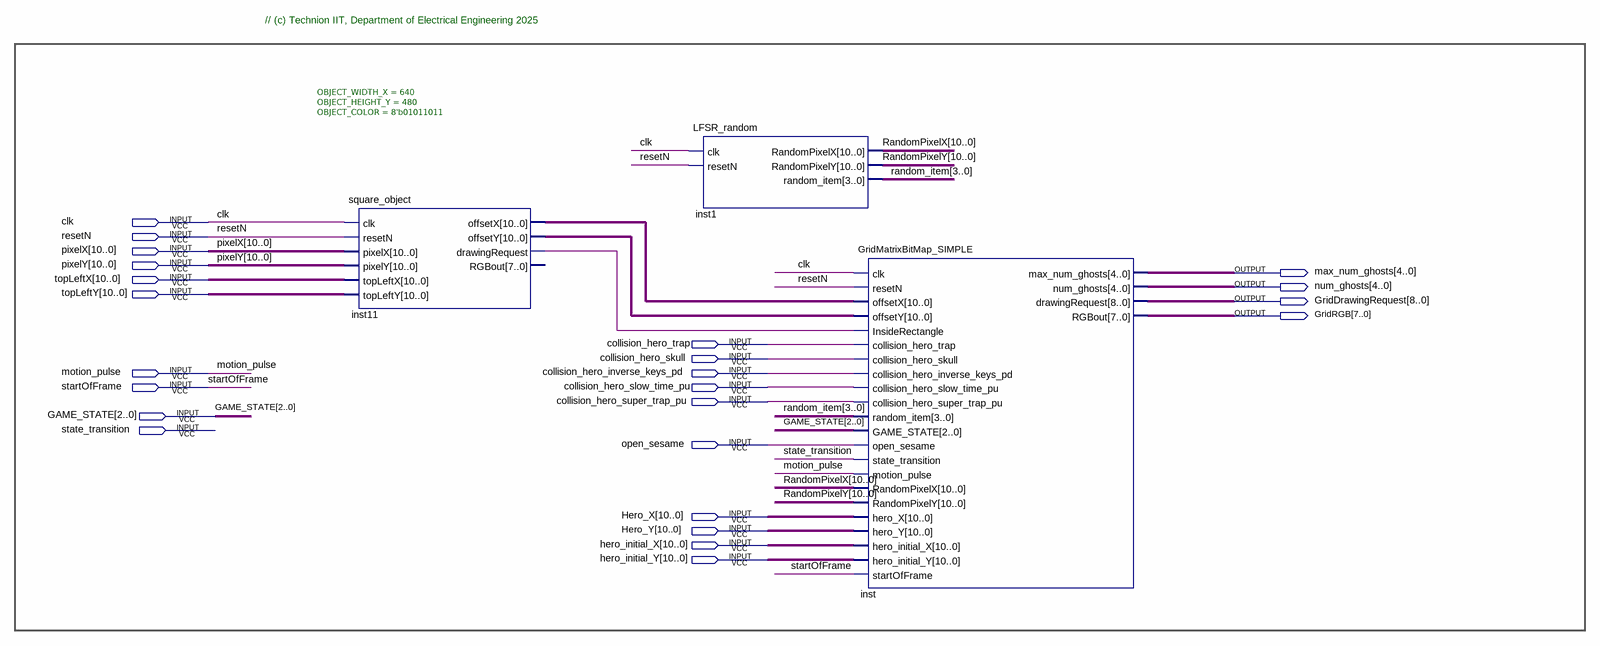
[diagram p0: schematic sheet]
// Quartus schematic OBJECTS_GRID.bdf as structural Verilog: 3 symbols, 24 pins
module OBJECTS_GRID (
  input  clk,
  input  resetN,
  input  [10:0] pixelX,
  input  [10:0] pixelY,
  input  [10:0] topLeftX,
  input  [10:0] topLeftY,
  input  collision_hero_trap,
  input  collision_hero_skull,
  input  motion_pulse,
  input  collision_hero_inverse_keys_pd,
  input  startOfFrame,
  input  collision_hero_slow_time_pu,
  input  collision_hero_super_trap_pu,
  input  [2:0] GAME_STATE,
  input  state_transition,
  input  open_sesame,
  input  [10:0] Hero_X,
  input  [10:0] Hero_Y,
  input  [10:0] hero_initial_X,
  input  [10:0] hero_initial_Y,
  output [4:0] max_num_ghosts,
  output [4:0] num_ghosts,
  output [8:0] GridDrawingRequest,
  output [7:0] GridRGB
);

  wire inst11_drawingrequest;
  wire [3:0] random_item;
  wire [10:0] inst11_offsetx, inst11_offsety, RandomPixelX, RandomPixelY;

  square_object #(.OBJECT_WIDTH_X(640), .OBJECT_HEIGHT_Y(480), .OBJECT_COLOR(8'b01011011)) inst11 (
    .clk(clk), .resetN(resetN), .pixelX(pixelX), .pixelY(pixelY), .topLeftX(topLeftX), .topLeftY(topLeftY),
    .offsetX(inst11_offsetx), .offsetY(inst11_offsety), .drawingRequest(inst11_drawingrequest));  // open: RGBout
  LFSR_random inst1 (
    .clk(clk), .resetN(resetN), .RandomPixelX(RandomPixelX), .RandomPixelY(RandomPixelY),
    .random_item(random_item));
  GridMatrixBitMap_SIMPLE inst (
    .clk(clk), .resetN(resetN), .offsetX(inst11_offsetx), .offsetY(inst11_offsety),
    .InsideRectangle(inst11_drawingrequest), .collision_hero_trap(collision_hero_trap),
    .collision_hero_skull(collision_hero_skull),
    .collision_hero_inverse_keys_pd(collision_hero_inverse_keys_pd),
    .collision_hero_slow_time_pu(collision_hero_slow_time_pu),
    .collision_hero_super_trap_pu(collision_hero_super_trap_pu), .random_item(random_item),
    .GAME_STATE(GAME_STATE), .open_sesame(open_sesame), .state_transition(state_transition),
    .motion_pulse(motion_pulse), .RandomPixelX(RandomPixelX), .RandomPixelY(RandomPixelY), .hero_X(Hero_X),
    .hero_Y(Hero_Y), .hero_initial_X(hero_initial_X), .hero_initial_Y(hero_initial_Y),
    .startOfFrame(startOfFrame), .max_num_ghosts(max_num_ghosts), .num_ghosts(num_ghosts),
    .drawingRequest(GridDrawingRequest), .RGBout(GridRGB));

  // Notes on the sheet:
  //   // (c) Technion IIT, Department of Electrical Engineering 2025
endmodule
